# EAGLE design lcd_buckler_mk_1.1 (EAGLE 6.5.0)
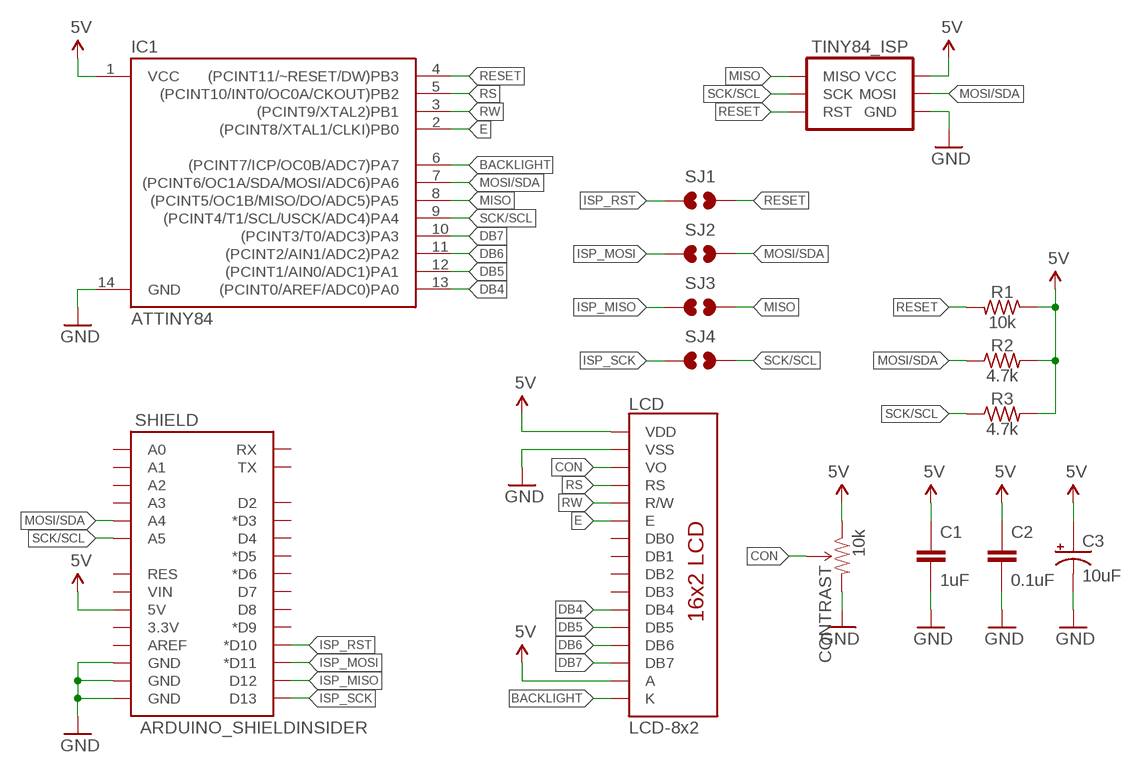
[diagram p0: schematic, sheet 1]

## Parts
C1  1uF  CAPACITOR-CERAMIC025-024X044  [C025-024X044]
C2  0.1uF  CAPACITOR-CERAMIC025-024X044  [C025-024X044]
C3  10uF  CAPACITOR-POLARIZEDE2.5-5  [E2,5-5]
CONTRAST  10k  TRIMPOTPTH  [TRIM_POT_PTH]
IC1  ATTINY84  ATTINY84ATTINY84-20PU  [DIL14]
LCD  LCD-8x2  LCD-16X28X2  [LCD-8X2]
R1  10k  RESISTORPTH-AXIAL-7.62MM  [RESISTOR-AXIAL-PTH-7.62MM]
R2  4.7k  RESISTORPTH-AXIAL-7.62MM  [RESISTOR-AXIAL-PTH-7.62MM]
R3  4.7k  RESISTORPTH-AXIAL-7.62MM  [RESISTOR-AXIAL-PTH-7.62MM]
SHIELD  ARDUINO_SHIELDINSIDER  [ARDUINO_SHIELD_NOOUTLINE_INSIDE]
SJ1  JUMPER-PAD-2-NO  [PAD-JUMPER-2-NO_NO_SILK]
SJ2  JUMPER-PAD-2-NO  [PAD-JUMPER-2-NO_NO_SILK]
SJ3  JUMPER-PAD-2-NO  [PAD-JUMPER-2-NO_NO_SILK]
SJ4  JUMPER-PAD-2-NO  [PAD-JUMPER-2-NO_NO_SILK]
TINY84_ISP  AVR_SPI_PRG_6PTH  [2X3]

## Nets
5V: C1.1 C2.1 C3.+ CONTRAST.1(CCW) IC1.1(VCC) LCD.2(VDD) LCD.15(A) R1.P$1 R2.P$2 R3.P$2 SHIELD.5V TINY84_ISP.2(VCC)
BACKLIGHT: IC1.6((PCINT7/ICP/OC0B/ADC7)PA7) LCD.16(K)
CON: CONTRAST.2(WIPER) LCD.3(VO)
DB4: IC1.13((PCINT0/AREF/ADC0)PA0) LCD.11(DB4)
DB5: IC1.12((PCINT1/AIN0/ADC1)PA1) LCD.12(DB5)
DB6: IC1.11((PCINT2/AIN1/ADC2)PA2) LCD.13(DB6)
DB7: IC1.10((PCINT3/T0/ADC3)PA3) LCD.14(DB7)
E: IC1.2((PCINT8/XTAL1/CLKI)PB0) LCD.6(E)
GND: C1.2 C2.2 C3.- CONTRAST.3(CW) IC1.14(GND) LCD.1(VSS) SHIELD.GND@0(GND) SHIELD.GND@1(GND) SHIELD.GND@2(GND) TINY84_ISP.6(GND)
ISP_MISO: SHIELD.D12 SJ3.1
ISP_MOSI: SHIELD.D11(*D11) SJ2.1
ISP_RST: SHIELD.D10(*D10) SJ1.1
ISP_SCK: SHIELD.D13 SJ4.1
MISO: IC1.8((PCINT5/OC1B/MISO/DO/ADC5)PA5) SJ3.2 TINY84_ISP.1(MISO)
MOSI/SDA: IC1.7((PCINT6/OC1A/SDA/MOSI/ADC6)PA6) R2.P$1 SHIELD.A4 SJ2.2 TINY84_ISP.4(MOSI)
RESET: IC1.4((PCINT11/~RESET/DW)PB3) R1.P$2 SJ1.2 TINY84_ISP.5(RST)
RS: IC1.5((PCINT10/INT0/OC0A/CKOUT)PB2) LCD.4(RS)
RW: IC1.3((PCINT9/XTAL2)PB1) LCD.5(R/W)
SCK/SCL: IC1.9((PCINT4/T1/SCL/USCK/ADC4)PA4) R3.P$1 SHIELD.A5 SJ4.2 TINY84_ISP.3(SCK)
Unconnected: LCD.7(DB0) LCD.8(DB1) LCD.9(DB2) LCD.10(DB3) SHIELD.3.3V SHIELD.A0 SHIELD.A1 SHIELD.A2 SHIELD.A3 SHIELD.AREF SHIELD.D2 SHIELD.D3(*D3) SHIELD.D4 SHIELD.D5(*D5) SHIELD.D6(*D6) SHIELD.D7 SHIELD.D8 SHIELD.D9(*D9) SHIELD.RES SHIELD.RX SHIELD.TX SHIELD.VIN

## Library data of the parts
C1 C2 = A_butts:CAPACITOR-CERAMIC: CAPACITOR, European symbol
C3 = A_butts:CAPACITOR-POLARIZED: POLARIZED CAPACITOR, American symbol
CONTRAST = A_butts:TRIMPOT: Various small potentiometers for "set-and-forget" applications
IC1 = A_butts:ATTINY84: Atmel 14-pin 2/4/8kB flash uC
LCD = A_butts:LCD-16X2: Standard text-only 16x2 parallel input LCD
R1-R3 = A_butts:RESISTOR: RESISTOR, American symbol
SHIELD = A_butts:ARDUINO_SHIELD: Arduino shield footprint
SJ1-SJ4 = A_butts:JUMPER-PAD-2-NO
TINY84_ISP = A_butts:AVR_SPI_PRG_6: AVR ISP 6 Pin This is the reduced ISP connector for AVR programming. Common on Arduino. This footprint will take up less PCB space and can be used with a 10-pin to 6-pin adapter such as SKU: BOB-08508 **Special note about "TEST_POINT" package. The stop mask is on the top side, so if you want your programming test points to be on the bottom of your board, make sure to place this package on the bottom side of the board. This also ensure that the orientation to program from the bottom side will be correct.

## Board
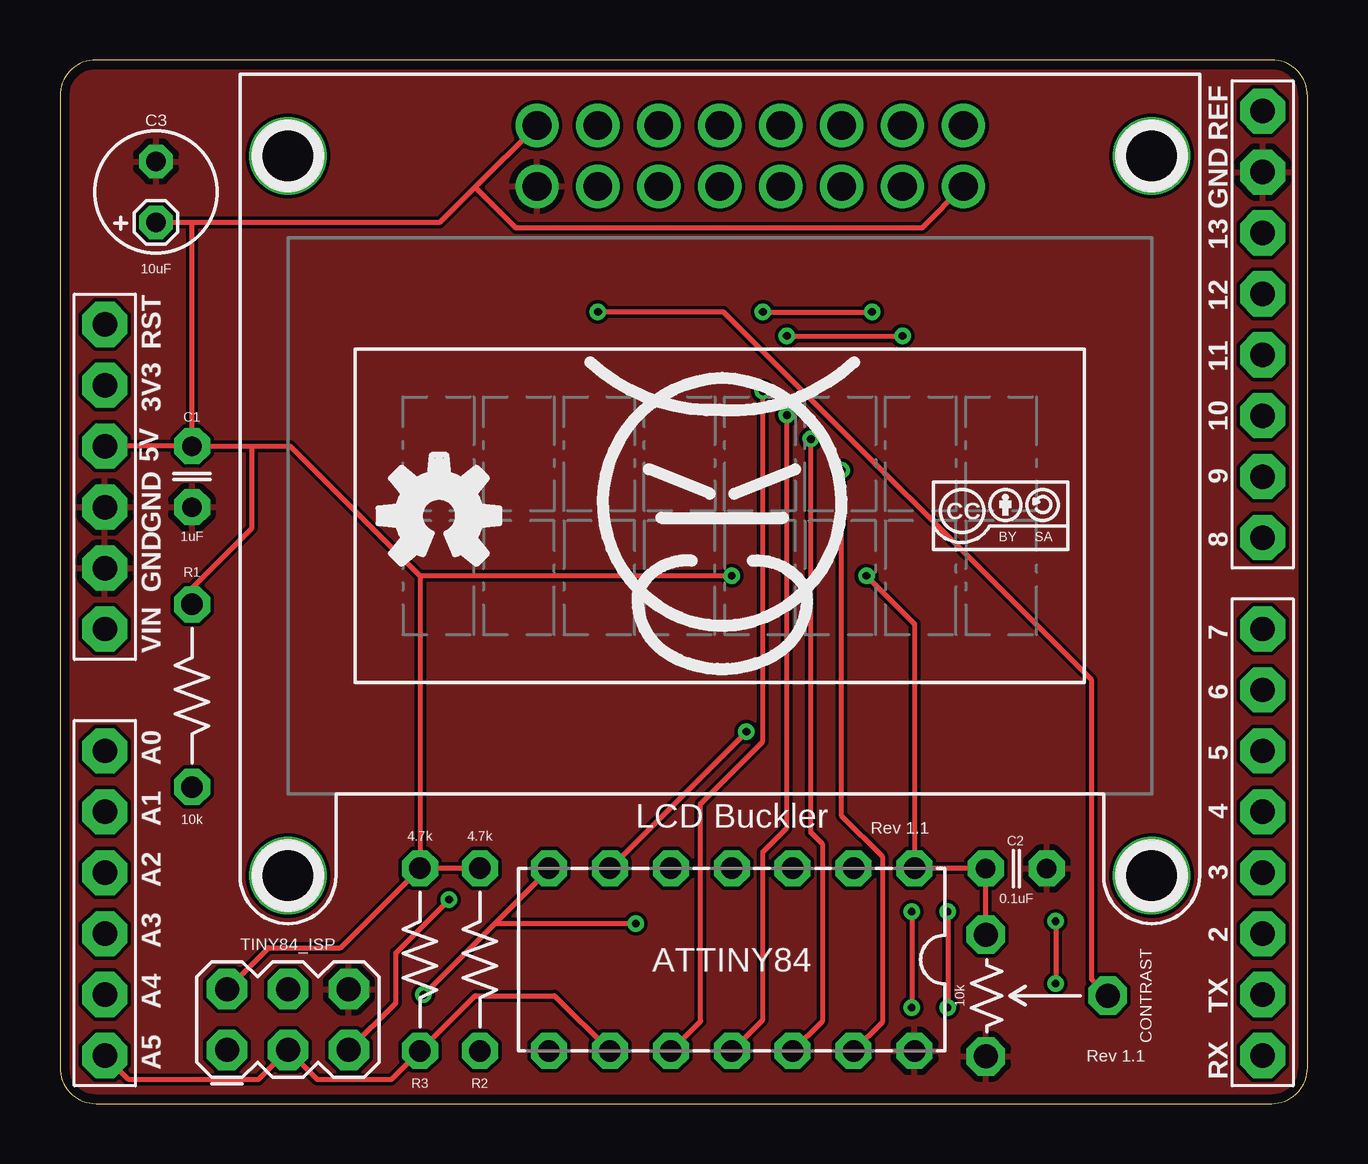
[diagram p1: board, top side]
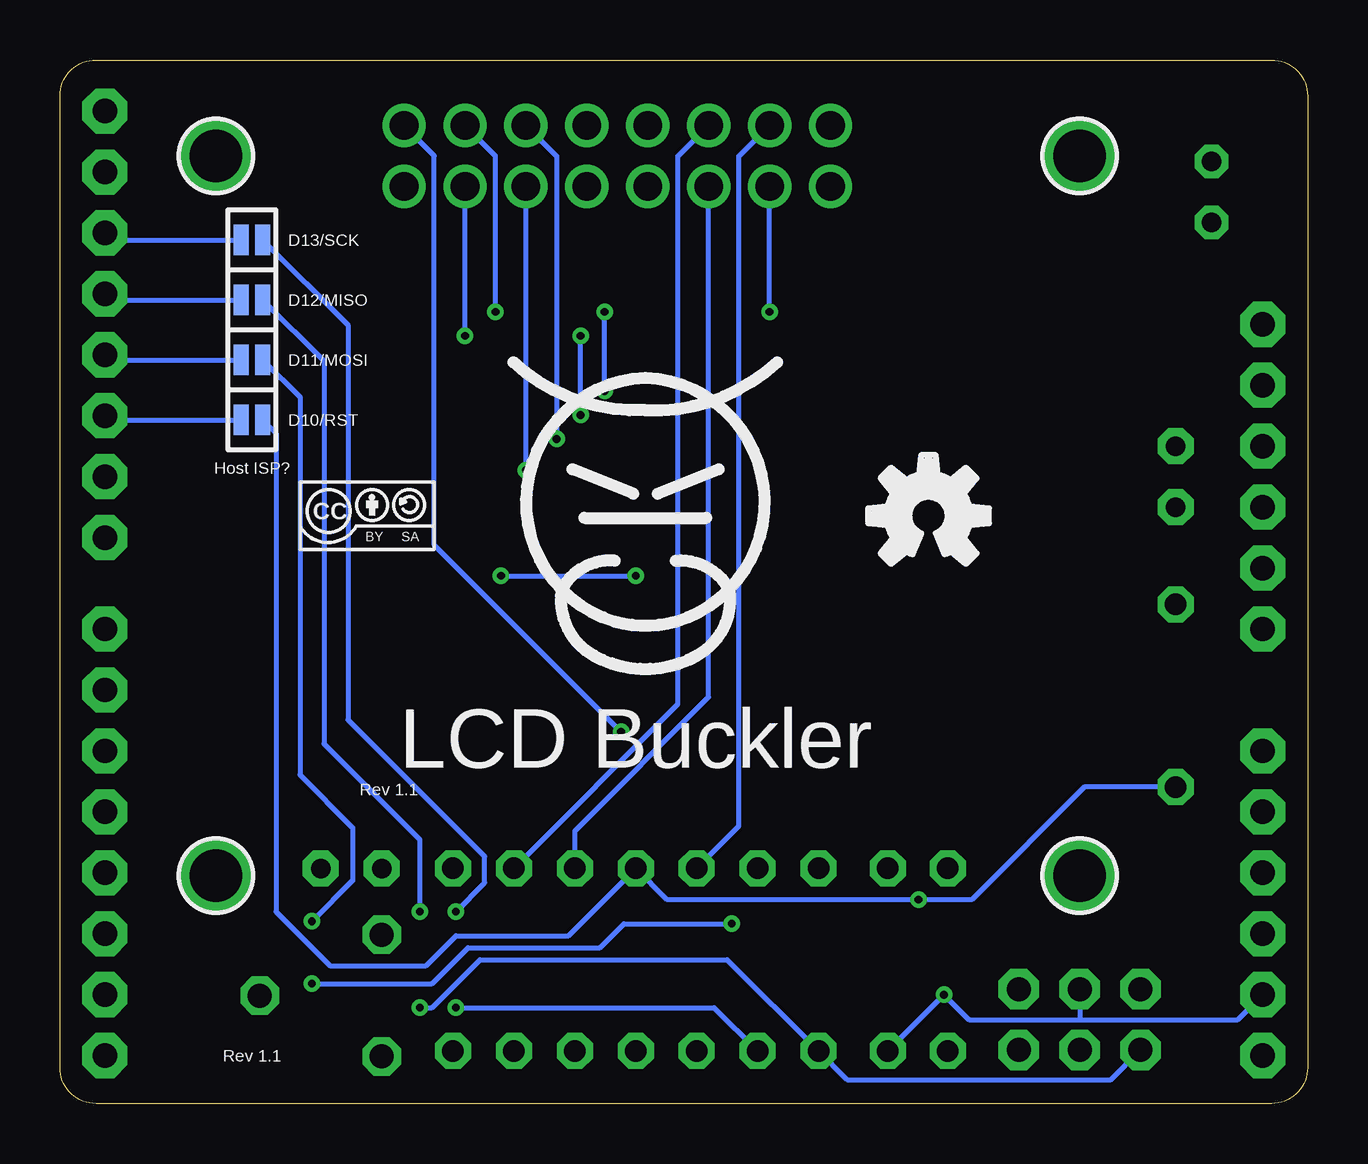
[diagram p2: board, bottom side, seen from below]

Size 52 x 43.5 mm. Coordinates in mm from the lower left corner, seen from the top.
Outline: 50.5,43.5 1.5,43.5 arc90 0,42 0,1.5 arc90 1.5,0 50.5,0 arc90 52,1.5 52,42 arc90 50.5,43.5
Copper layers (1*16): Top 0.0356mm / dielectric 1.5011mm / Bottom 0.0356mm
Design rules "LaenPCBOrder_2": minimum track width 6mil, minimum drill 13mil, track to track 6mil, track to pad 6mil, pad to pad 6mil, via to via 6mil, smd to smd 6mil, copper to edge 15mil, drill to drill 6mil, minimum pad ring 7mil, minimum via ring 7mil, stop-mask expansion 3mil, vias tented up to drill 20mil, thermal gap 10mil

### Footprints (pad centres in the part's own frame; a part is rotated, then mirrored left to right if it is on the bottom)
C025-024X044 = drill 0.813 pad 1.5 octagon: 1 -1.27,0; 2 1.27,0
E2,5-5 = drill 0.8 pad 1.4 octagon: + -1.27,0; - 1.27,0
TRIM_POT_PTH = drill 1 pad 1.6 octagon: 1 -2.54,-2.54; 2 0,2.54; 3 2.54,-2.54
DIL14 = drill 0.9 pad 1.5 octagon: 1 -7.62,-3.81; 2 -5.08,-3.81; 3 -2.54,-3.81; 4 0,-3.81; 5 2.54,-3.81; 6 5.08,-3.81; 7 7.62,-3.81; 8 7.62,3.81; 9 5.08,3.81; 10 2.54,3.81; 11 0,3.81; 12 -2.54,3.81; 13 -5.08,3.81; 14 -7.62,3.81
LCD-8X2 = drill 1.2 pad 1.778: 1 -7.62,13.73; 2 -7.62,16.27; 3 -5.08,13.73; 4 -5.08,16.27; 5 -2.54,13.73; 6 -2.54,16.27; 7 0,13.73; 8 0,16.27; 9 2.54,13.73; 10 2.54,16.27; 11 5.08,13.73; 12 5.08,16.27; 13 7.62,13.73; 14 7.62,16.27; 15 10.16,13.73; 16 10.16,16.27 | drill 2.2 pad 3: P$1 -18,-15; P$2 -18,15; P$3 18,15; P$4 18,-15
RESISTOR-AXIAL-PTH-7.62MM = drill 0.9 pad 1.5 octagon: P$1 -3.81,0; P$2 3.81,0
ARDUINO_SHIELD_NOOUTLINE_INSIDE = drill 1.016 pad 1.88 octagon: 3.3V 48.26,-27.94; 5V 48.26,-25.4; A0 48.26,-12.7; A1 48.26,-10.16; A2 48.26,-7.62; A3 48.26,-5.08; A4 48.26,-2.54; A5 48.26,0; AREF 0,-39.37; D2 0,-5.08; D3 0,-7.62; D4 0,-10.16; D5 0,-12.7; D6 0,-15.24; D7 0,-17.78; D8 0,-21.59; D9 0,-24.13; D10 0,-26.67; D11 0,-29.21; D12 0,-31.75; D13 0,-34.29; GND@0 48.26,-22.86; GND@1 48.26,-20.32; GND@2 0,-36.83; RES 48.26,-30.48; RX 0,0; TX 0,-2.54; VIN 48.26,-17.78
PAD-JUMPER-2-NO_NO_SILK = smd 0.635 x 1.27: 1 -0.45,0; 2 0.45,0
2X3 = drill 1 pad 1.676 octagon: 1 -2.54,-1.27; 2 -2.54,1.27; 3 0,-1.27; 4 0,1.27; 5 2.54,-1.27; 6 2.54,1.27

### Placement (x,y rotation side)
C1  5.5,26.13 270 top
C2  39.86,9.8 0 top
C3  4,38 90 top
CONTRAST  41.13,4.5 270 top
IC1  28,6 180 top
LCD  27.5,24.5 0 top
R1  5.5,17 270 top
R2  17.5,6 90 top
R3  15,6 90 top
SHIELD  50.13,2 180 top
SJ1  44,28.5 0 bottom
SJ2  44,31 0 bottom
SJ3  44,33.5 0 bottom
SJ4  44,36 0 bottom
TINY84_ISP  9.5,3.5 0 top
U$1  [COW]  27.6,23.9 0 bottom
U$2  [COW]  27.6,23.9 0 top
U$3  [CC-BY-SA-4.0-NO-URL]  39.2,24.5 0 bottom
U$4  [CC-BY-SA-4.0-NO-URL]  39.2,24.5 0 top
U$5  [OSHWLOGO_SILKONLY]  15.8,24.5 0 top
U$6  [OSHWLOGO_SILKONLY]  15.8,24.5 0 bottom

### Tracks (layer width: path | path; a pad name or v marks a point on that pad's centre or on a via)
5V  (via drill 0.33)
  Top 0.2: C1.1 SHIELD.5V | R2.P$2 R3.P$2 | C3.+ 5.5,36.73 | 5.5,36.73 15.84,36.73 17.3,38.2 | 17.3,38.2 LCD.2 | v33.62,22 35.62,20 IC1.1 C2.1 CONTRAST.1 | LCD.15 35.93,36.5 19,36.5 17.3,38.2 | TINY84_ISP.2 8.69,6.5 11.69,6.5 R3.P$2 | v28,22 15,22 | 15,22 R3.P$2 | C1.1 8,27.4 | 8,27.4 9.6,27.4 15,22 | R1.P$1 5.5,21.5 8,24 8,27.4 | C1.1 5.5,36.73
  Bottom 0.2: v33.62,22 v28,22
BACKLIGHT  (via drill 0.33)
  Top 0.2: IC1.6 v28.61,15.5
  Bottom 0.2: LCD.16 36.4,39.51 36.4,23.29 v28.61,15.5
CON  (via drill 0.33)
  Top 0.2: v22.42,33 27.65,33 43,17.65 43,5.17 CONTRAST.2
  Bottom 0.2: v22.42,33 LCD.3
DB4  (via drill 0.33)
  Top 0.2: IC1.13 34.3,3.41 34.3,10.28 32.58,12 v32.58,26.4
  Bottom 0.2: v32.58,26.4 LCD.11
DB5  (via drill 0.33)
  Top 0.2: IC1.12 31.8,3.45 31.8,10.8 31.3,11.3 v31.3,27.7
  Bottom 0.2: LCD.12 31.3,39.49 v31.3,27.7
DB6  (via drill 0.33)
  Top 0.2: IC1.11 29.3,3.49 29.3,10.5 30.3,11.5 v30.3,28.7 | v30.3,32 v35.12,32
  Bottom 0.2: v30.3,28.7 v30.3,32 | v35.12,32 LCD.13
DB7  (via drill 0.33)
  Top 0.2: IC1.10 26.7,3.43 26.7,12.5 29.3,15.1 v29.3,29.7 | v29.3,33 v33.85,33
  Bottom 0.2: v29.3,29.7 v29.3,33 | LCD.14 33.85,39.5 v33.85,33
E
  Bottom 0.2: LCD.6 26.24,39.49 26.24,16.65 IC1.2
GND
  pour Top: 50.5,0 1.5,0 arc-90 0,1.5 0,42 arc-90 1.5,43.5 50.5,43.5 arc-90 52,42 52,1.5 arc-90
ISP_MISO
  Bottom 0.2: SHIELD.D12 49.88,33.5 SJ3.1
ISP_MOSI
  Bottom 0.2: SHIELD.D11 49.92,31 SJ2.1
ISP_RST
  Bottom 0.2: SHIELD.D10 49.96,28.5 SJ1.1
ISP_SCK
  Bottom 0.2: SHIELD.D13 49.84,36 SJ4.1
MISO  (via drill 0.33)
  Top 0.2: v37,8 v37,4
  Bottom 0.2: TINY84_ISP.1 8.19,1 19.19,1 IC1.8 24.19,6 34.5,6 36.5,4 v37,4 | SJ3.2 41,30.95 41,15 37,11 v37,8
MOSI/SDA  (via drill 0.33)
  Top 0.2: v15.15,4.54 18.11,7.5 | 18.11,7.5 20.38,9.77 IC1.7 | v24,7.5 18.11,7.5 | v41.5,7.6 v41.5,5
  Bottom 0.2: R2.P$1 v15.15,4.54 14.11,3.5 9.5,3.5 | 9.5,3.5 2.91,3.5 SHIELD.A4 | TINY84_ISP.4 9.5,3.5 | SJ2.2 42,29.45 42,13.7 39.8,11.5 39.8,9.3 v41.5,7.6 | v41.5,5 36.5,5 35,6.5 29.5,6.5 28.5,7.5 v24,7.5
RESET  (via drill 0.33)
  Top 0.2: TINY84_ISP.5 14,4.19 14,6.29 v16.21,8.5
  Bottom 0.2: R1.P$2 9.31,13.19 14,8.5 v16.21,8.5 26.69,8.5 IC1.4 30.81,7 35.5,7 36.75,5.75 40.75,5.75 43,8 43,27.95 SJ1.2
RS
  Bottom 0.2: LCD.4 23.7,39.49 23.7,11.57 IC1.5
RW
  Bottom 0.2: IC1.3 30.54,11.36 24.96,16.94 LCD.5
SCK/SCL  (via drill 0.33)
  Top 0.2: IC1.9 20.61,4.5 17.31,4.5 R3.P$1 13.81,1 10.73,1 TINY84_ISP.3 8.27,1 2.87,1 SHIELD.A5 | v35.5,8 v35.5,4
  Bottom 0.2: SJ4.2 40,32.45 40,16 34.3,10.3 34.3,9.2 v35.5,8 | v35.5,4 24.73,4 IC1.9

### Text on the board
tPlace: LCD Buckler | Rev 1.1 | Rev 1.1
bPlace: D13/SCK | D12/MISO | D11/MOSI | D10/RST | Host ISP? | LCD Buckler | Rev 1.1 | Rev 1.1